# EAGLE design sensors (EAGLE 9.2.0)
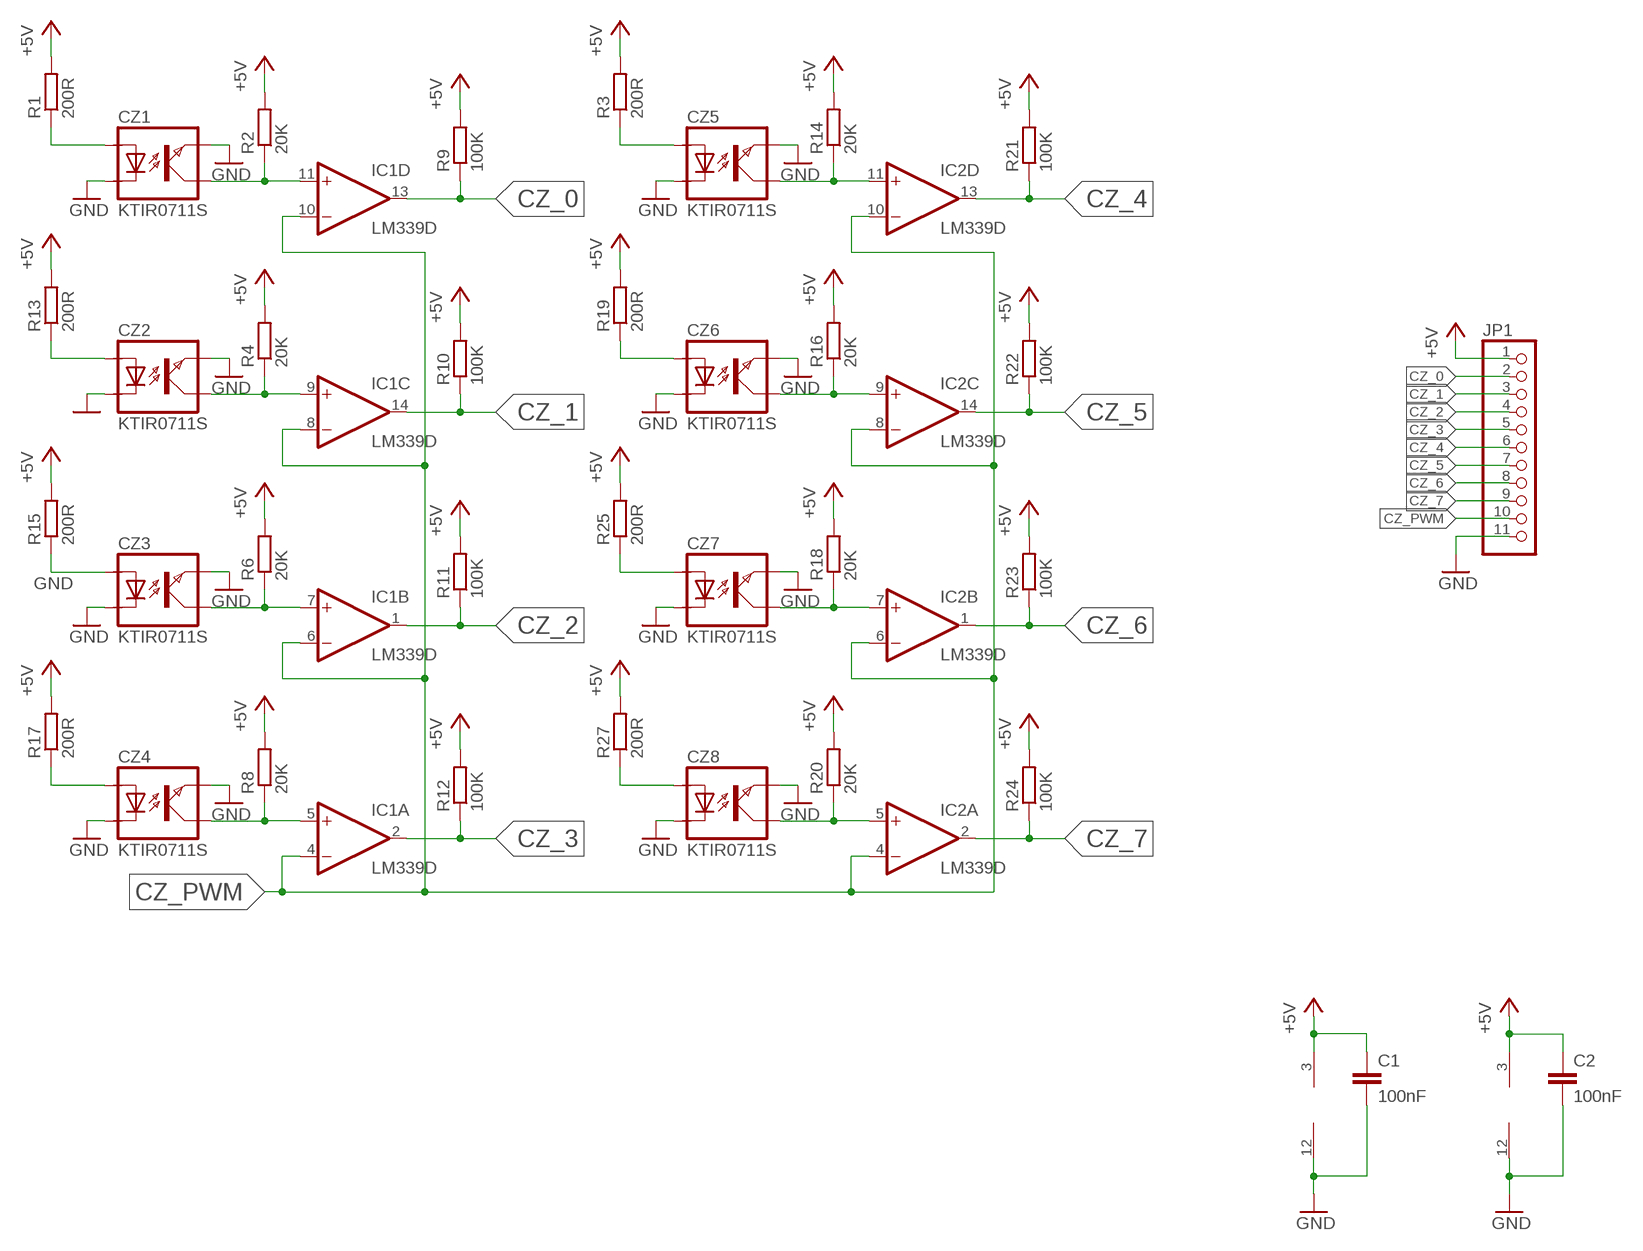
[diagram p0: schematic, sheet 1]

## Parts
C1  100nF  C-EUC0805K  [C0805K]
C2  100nF  C-EUC0805K  [C0805K]
CZ1  KTIR0711S  [TOP]
CZ2  KTIR0711S  [TOP]
CZ3  KTIR0711S  [TOP]
CZ4  KTIR0711S  [TOP]
CZ5  KTIR0711S  [TOP]
CZ6  KTIR0711S  [TOP]
CZ7  KTIR0711S  [TOP]
CZ8  KTIR0711S  [TOP]
IC1  LM339D  [SO14]
IC2  LM339D  [SO14]
JP1  PINHD-1X11  [1X11]
R1  200R  R-EU_R0805  [R0805]
R2  20K  R-EU_R0805  [R0805]
R3  200R  R-EU_R0805  [R0805]
R4  20K  R-EU_R0805  [R0805]
R6  20K  R-EU_R0805  [R0805]
R8  20K  R-EU_R0805  [R0805]
R9  100K  R-EU_R0805  [R0805]
R10  100K  R-EU_R0805  [R0805]
R11  100K  R-EU_R0805  [R0805]
R12  100K  R-EU_R0805  [R0805]
R13  200R  R-EU_R0805  [R0805]
R14  20K  R-EU_R0805  [R0805]
R15  200R  R-EU_R0805  [R0805]
R16  20K  R-EU_R0805  [R0805]
R17  200R  R-EU_R0805  [R0805]
R18  20K  R-EU_R0805  [R0805]
R19  200R  R-EU_R0805  [R0805]
R20  20K  R-EU_R0805  [R0805]
R21  100K  R-EU_R0805  [R0805]
R22  100K  R-EU_R0805  [R0805]
R23  100K  R-EU_R0805  [R0805]
R24  100K  R-EU_R0805  [R0805]
R25  200R  R-EU_R0805  [R0805]
R27  200R  R-EU_R0805  [R0805]

## Nets
+5V: C1.1 C2.1 IC1.3(P:V+) IC2.3(P:V+) JP1.1 R1.2 R2.2 R3.2 R4.2 R6.2 R8.2 R9.2 R10.2 R11.2 R12.2 R13.2 R14.2 R15.2 R16.2 R17.2 R18.2 R19.2 R20.2 R21.2 R22.2 R23.2 R24.2 R25.2 R27.2
CZ_0: IC1.13(D:OUT) JP1.2 R9.1
CZ_1: IC1.14(C:OUT) JP1.3 R10.1
CZ_2: IC1.1(B:OUT) JP1.4 R11.1
CZ_3: IC1.2(A:OUT) JP1.5 R12.1
CZ_4: IC2.13(D:OUT) JP1.6 R21.1
CZ_5: IC2.14(C:OUT) JP1.7 R22.1
CZ_6: IC2.1(B:OUT) JP1.8 R23.1
CZ_7: IC2.2(A:OUT) JP1.9 R24.1
CZ_PWM: IC1.4(A:-IN) IC1.6(B:-IN) IC1.8(C:-IN) IC1.10(D:-IN) IC2.4(A:-IN) IC2.6(B:-IN) IC2.8(C:-IN) IC2.10(D:-IN) JP1.10
GND: C1.2 C2.2 CZ1.EMITER CZ1.KATODA CZ2.EMITER CZ2.KATODA CZ3.EMITER CZ3.KATODA CZ4.EMITER CZ4.KATODA CZ5.EMITER CZ5.KATODA CZ6.EMITER CZ6.KATODA CZ7.EMITER CZ7.KATODA CZ8.EMITER CZ8.KATODA IC1.12(P:GND) IC2.12(P:GND) JP1.11
N$1: CZ1.KOLEKTOR IC1.11(D:+IN) R2.1
N$2: CZ2.KOLEKTOR IC1.9(C:+IN) R4.1
N$3: CZ3.ANODA R15.1
N$4: CZ1.ANODA R1.1
N$5: CZ5.ANODA R3.1
N$6: CZ3.KOLEKTOR IC1.7(B:+IN) R6.1
N$7: CZ2.ANODA R13.1
N$8: CZ4.KOLEKTOR IC1.5(A:+IN) R8.1
N$9: CZ4.ANODA R17.1
N$11: CZ6.ANODA R19.1
N$12: CZ8.ANODA R27.1
N$14: CZ5.KOLEKTOR IC2.11(D:+IN) R14.1
N$15: CZ7.ANODA R25.1
N$16: CZ6.KOLEKTOR IC2.9(C:+IN) R16.1
N$18: CZ7.KOLEKTOR IC2.7(B:+IN) R18.1
N$20: CZ8.KOLEKTOR IC2.5(A:+IN) R20.1

## Library data of the parts
C1 C2 = rcl:C-EU: CAPACITOR, European symbol; SPICEPREFIX: C
CZ1-CZ8 = KTIR0711S:KTIR0711S
IC1 IC2 = Comparators,LM339:LM339: Low Power Low Offset Voltage Quad Comparators with open collector; LM139/LM239/LM339/LM2901/LM3302
JP1 = pinhead:PINHD-1X11: PIN HEADER
R1-R4 R6 R8-R25 R27 = rcl:R-EU_: RESISTOR, European symbol; SPICEPREFIX: R

## Board
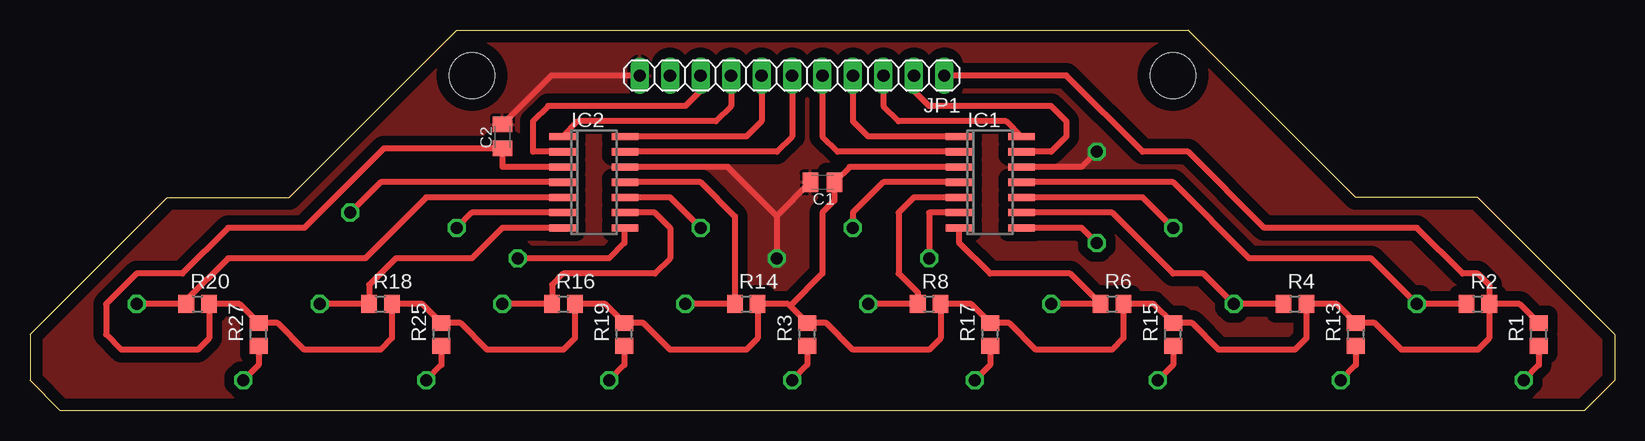
[diagram p1: board, top side]
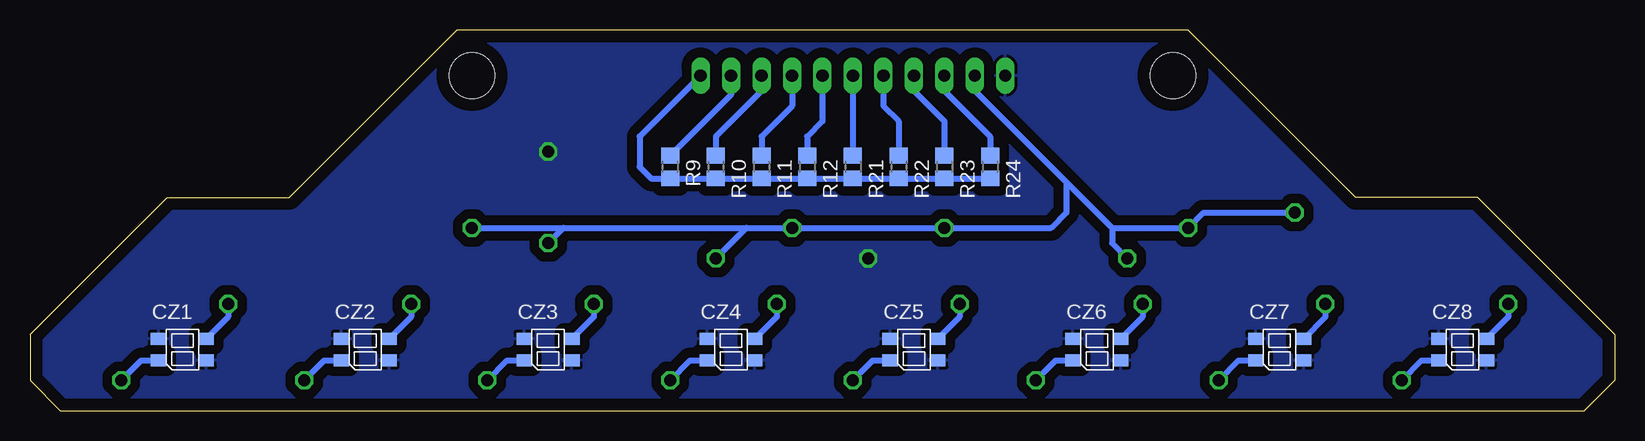
[diagram p2: board, bottom side, seen from below]

Size 132.08 x 31.75 mm. Coordinates in mm from the lower left corner, seen from the top.
Outline: 132.08,6.35 132.08,2.54 129.54,0 2.54,0 0,2.54 0,6.35 11.43,17.78 21.59,17.78 35.56,31.75 96.52,31.75 110.49,17.78 120.65,17.78 132.08,6.35
Copper layers (1*16): Top 0.035mm / dielectric 1.5mm / Bottom 0.035mm
Design rules "default": minimum track width 6mil, minimum drill 0.35mm, track to track 6mil, track to pad 6mil, pad to pad 6mil, via to via 6mil, smd to smd 6mil, copper to edge 40mil, drill to drill 6mil, minimum pad ring 10mil, minimum via ring 8mil, stop-mask expansion 4mil, vias tented up to drill 0mil, thermal gap 10mil
Holes 3.81 mm at 36.83,27.94 95.25,27.94

### Footprints (pad centres in the part's own frame; a part is rotated, then mirrored left to right if it is on the bottom)
C0805K = smd 1.3 x 1.6: 1 -1,0; 2 1,0
TOP = smd 1.27 x 1: ANODA -1.985,-0.9; EMITER -1.985,0.9; KATODA 1.985,-0.9; KOLEKTOR 1.985,0.91
SO14 = smd 0.6 x 2.2: 1 -3.81,-2.6; 2 -2.54,-2.6; 3 -1.27,-2.6; 4 0,-2.6; 5 1.27,-2.6; 6 2.54,-2.6; 7 3.81,-2.6; 8 3.81,2.6; 9 2.54,2.6; 10 1.27,2.6; 11 0,2.6; 12 -1.27,2.6; 13 -2.54,2.6; 14 -3.81,2.6
1X11 = drill 1.016 long: 1 -12.7,0; 2 -10.16,0; 3 -7.62,0; 4 -5.08,0; 5 -2.54,0; 6 0,0; 7 2.54,0; 8 5.08,0; 9 7.62,0; 10 10.16,0; 11 12.7,0
R0805 = smd 1.3 x 1.5: 1 -0.95,0; 2 0.95,0

### Placement (x,y rotation side)
C1  66.04,19.05 180 top
C2  39.37,22.86 90 top
CZ1  119.38,5.08 0 bottom
CZ2  104.14,5.08 0 bottom
CZ3  88.9,5.08 0 bottom
CZ4  73.66,5.08 0 bottom
CZ5  58.42,5.08 0 bottom
CZ6  43.18,5.08 0 bottom
CZ7  27.94,5.08 0 bottom
CZ8  12.7,5.08 0 bottom
IC1  80.01,19.05 270 top
IC2  46.99,19.05 270 top
JP1  63.5,27.94 180 top
R1  125.73,6.35 90 top
R2  120.65,8.89 0 top
R3  64.77,6.35 90 top
R4  105.41,8.89 0 top
R6  90.17,8.89 0 top
R8  74.93,8.89 0 top
R9  78.74,20.32 270 bottom
R10  74.93,20.32 270 bottom
R11  71.12,20.32 270 bottom
R12  67.31,20.32 270 bottom
R13  110.49,6.35 90 top
R14  59.69,8.89 0 top
R15  95.25,6.35 90 top
R16  44.45,8.89 0 top
R17  80.01,6.35 90 top
R18  29.21,8.89 0 top
R19  49.53,6.35 90 top
R20  13.97,8.89 0 top
R21  63.5,20.32 270 bottom
R22  59.69,20.32 270 bottom
R23  55.88,20.32 270 bottom
R24  52.07,20.32 270 bottom
R25  34.29,6.35 90 top
R27  19.05,6.35 90 top

### Tracks (layer width: path | path; a pad name or v marks a point on that pad's centre or on a via)
+5V
  Top 0.508: 63.34,8.73 R3.2 66.36,7.3 68.58,5.08 74.93,5.08 75.88,6.03 R8.2 78.42,8.89 R17.2 81.6,7.3 83.82,5.08 90.17,5.08 91.12,6.03 R6.2 93.66,8.89 R15.2 96.84,7.3 99.06,5.08 105.41,5.08 106.36,6.03 R4.2 108.9,8.89 R13.2 112.08,7.3 114.3,5.08 120.65,5.08 121.6,6.03 R2.2 | 63.34,8.73 63.18,8.89 R14.2 60.64,6.03 59.69,5.08 53.34,5.08 51.12,7.3 R19.2 47.94,8.89 R16.2 45.4,6.03 44.45,5.08 38.1,5.08 35.88,7.3 R25.2 32.7,8.89 R18.2 30.16,6.03 29.21,5.08 22.86,5.08 20.64,7.3 R27.2 17.46,8.89 R20.2 14.92,6.03 13.97,5.08 7.62,5.08 6.35,6.35 6.35,8.89 8.89,11.43 12.7,11.43 16.51,15.24 22.86,15.24 29.48,21.86 C2.1 39.37,20.32 IC2.3 | R2.2 124.14,8.89 R1.2 | JP1.1 86.36,27.94 92.71,21.59 96.52,21.59 102.87,15.24 115.57,15.24 119.38,11.43 120.65,11.43 121.6,10.48 R2.2 | IC1.3 68.31,20.32 C1.1 67.04,17.51 66.04,16.51 66.04,11.43 63.34,8.73
  Bottom 0.508: R24.2 R23.2 R22.2 R21.2 R12.2 R11.2 R10.2 R9.2 80.33,19.37 81.28,20.32 81.28,22.86 JP1.1
CZ_0
  Top 0.508: JP1.2 73.66,26.67 74.93,25.4 85.09,25.4 86.36,24.13 86.36,22.86 85.09,21.59 IC1.13
  Bottom 0.508: R9.1 73.66,26.35 JP1.2
CZ_1
  Top 0.508: JP1.3 71.12,25.4 72.39,24.13 81.34,24.13 IC1.14
  Bottom 0.508: R10.1 74.93,22.86 71.12,26.67 JP1.3
CZ_2
  Top 0.508: IC1.1 69.85,22.86 68.58,24.13 JP1.4
  Bottom 0.508: R11.1 71.12,22.86 68.58,25.4 JP1.4
CZ_3
  Top 0.508: IC1.2 67.31,21.59 66.04,22.86 JP1.5
  Bottom 0.508: R12.1 67.31,22.86 66.04,24.13 JP1.5
CZ_4
  Top 0.508: IC2.13 62.23,21.59 63.5,22.86 JP1.6
  Bottom 0.508: JP1.6 R21.1
CZ_5
  Top 0.508: IC2.14 59.69,22.86 60.96,24.13 JP1.7
  Bottom 0.508: R22.1 59.69,24.13 60.96,25.4 JP1.7
CZ_6
  Top 0.508: IC2.1 45.66,24.13 57.15,24.13 58.42,25.4 JP1.8
  Bottom 0.508: R23.1 55.88,24.13 58.42,26.67 JP1.8
CZ_7
  Top 0.508: IC2.2 41.91,21.59 41.91,24.13 43.18,25.4 54.61,25.4 55.88,26.67 JP1.9
  Bottom 0.508: R24.1 52.07,22.86 55.88,26.67 JP1.9
CZ_PWM  (via drill 1)
  Top 0.508: IC2.10 53.34,17.78 v55.88,15.24 | IC1.6 74.93,16.51 v74.93,12.7 | v88.9,13.97 87.63,15.24 IC1.8 | IC2.8 49.53,15.18 49.53,13.97 48.26,12.7 v40.64,12.7 | v35.56,15.24 36.83,16.51 IC2.6 | IC1.10 92.71,17.78 v95.25,15.24 | IC1.4 71.12,19.05 68.58,16.51 v68.58,15.24 | IC2.4 29.21,19.05 v26.67,16.51
  Bottom 0.508: JP1.10 53.34,26.67 45.72,19.05 | 41.91,15.24 v35.56,15.24 34.29,16.51 v26.67,16.51 | 45.72,19.05 41.91,15.24 | v40.64,12.7 41.91,13.97 41.91,15.24 | 45.72,19.05 45.72,16.51 46.99,15.24 v55.88,15.24 v68.58,15.24 72.39,15.24 | v74.93,12.7 72.39,15.24 | v88.9,13.97 87.63,15.24 | 87.63,15.24 72.39,15.24 | v95.25,15.24 87.63,15.24
GND  (via drill 1)
  Top 0.508: IC1.12 87.63,20.32 v88.9,21.59 | C1.2 62.23,16.24 | 62.23,16.24 v62.23,12.7 | 62.23,16.24 58.15,20.32 IC2.12 | C2.2 43.45,27.94 JP1.11
  pour Top (isolate 0.813): 35.56,31.75 21.59,17.78 11.43,17.78 0,6.35 0,2.54 2.54,0 129.54,0 132.08,2.54 132.08,6.35 120.65,17.78 110.49,17.78 96.52,31.75
  pour Bottom (isolate 0.813): 35.56,31.75 21.59,17.78 11.43,17.78 0,6.35 0,2.54 2.54,0 129.54,0 132.08,2.54 132.08,6.35 120.65,17.78 110.49,17.78 96.52,31.75
N$1  (via drill 1)
  Top 0.508: R2.1 v115.57,8.89 111.76,12.7 101.6,12.7 95.25,19.05 IC1.11
  Bottom 0.508: CZ1.KOLEKTOR 115.57,7.82 v115.57,8.89
N$2  (via drill 1)
  Top 0.508: R4.1 v100.33,8.89 97.79,11.43 95.25,11.43 90.17,16.51 IC1.9
  Bottom 0.508: CZ2.KOLEKTOR 100.33,7.82 v100.33,8.89
N$3  (via drill 1)
  Top 0.508: v93.98,2.54 95.25,3.81 R15.1
  Bottom 0.508: CZ3.ANODA 92.34,4.18 v93.98,2.54
N$4  (via drill 1)
  Top 0.508: v124.46,2.54 125.73,3.81 R1.1
  Bottom 0.508: CZ1.ANODA 122.82,4.18 v124.46,2.54
N$5  (via drill 1)
  Top 0.508: v63.5,2.54 64.77,3.81 R3.1
  Bottom 0.508: CZ5.ANODA 61.86,4.18 v63.5,2.54
N$6  (via drill 1)
  Top 0.508: v85.09,8.89 R6.1 86.68,11.43 80.01,11.43 77.41,14.03 IC1.7
  Bottom 0.508: CZ3.KOLEKTOR 85.09,7.82 v85.09,8.89
N$7  (via drill 1)
  Top 0.508: v109.22,2.54 110.49,3.81 R13.1
  Bottom 0.508: CZ2.ANODA 107.58,4.18 v109.22,2.54
N$8  (via drill 1)
  Top 0.508: v69.85,8.89 R8.1 73.98,9.84 72.39,11.43 72.39,16.51 73.66,17.78 IC1.5
  Bottom 0.508: CZ4.KOLEKTOR 69.85,7.82 v69.85,8.89
N$9  (via drill 1)
  Top 0.508: v78.74,2.54 80.01,3.81 R17.1
  Bottom 0.508: CZ4.ANODA 77.1,4.18 v78.74,2.54
N$11  (via drill 1)
  Top 0.508: v48.26,2.54 49.53,3.81 R19.1
  Bottom 0.508: CZ6.ANODA 46.62,4.18 v48.26,2.54
N$12  (via drill 1)
  Top 0.508: v17.78,2.54 19.05,3.81 R27.1
  Bottom 0.508: CZ8.ANODA 16.14,4.18 v17.78,2.54
N$14  (via drill 1)
  Top 0.508: v54.61,8.89 R14.1 58.74,16.19 55.88,19.05 IC2.11
  Bottom 0.508: CZ5.KOLEKTOR 54.61,7.82 v54.61,8.89
N$15  (via drill 1)
  Top 0.508: v33.02,2.54 34.29,3.81 R25.1
  Bottom 0.508: CZ7.ANODA 31.38,4.18 v33.02,2.54
N$16  (via drill 1)
  Top 0.508: v39.37,8.89 R16.1 43.5,10.48 44.45,11.43 52.07,11.43 53.34,12.7 53.34,15.24 52.07,16.51 IC2.9
  Bottom 0.508: CZ6.KOLEKTOR 39.37,7.82 v39.37,8.89
N$18  (via drill 1)
  Top 0.508: v24.13,8.89 R18.1 28.26,10.48 30.48,12.7 36.83,12.7 39.37,15.24 IC2.7
  Bottom 0.508: CZ7.KOLEKTOR 24.13,7.82 v24.13,8.89
N$20  (via drill 1)
  Top 0.508: v8.89,8.89 R20.1 13.02,9.21 16.51,12.7 27.94,12.7 33.02,17.78 IC2.5
  Bottom 0.508: CZ8.KOLEKTOR 8.89,7.82 v8.89,8.89